# EAGLE schematic BARRERA (EAGLE 6.5.0)
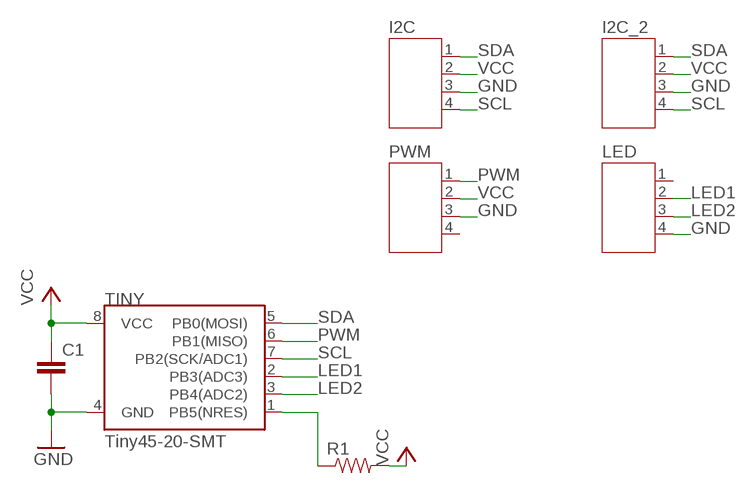
[diagram p0: schematic, sheet 1]

## Parts
C1  CAP0603-CAP  [0603-CAP]
I2C  JST-PH4  [JST-PH4]
I2C_2  JST-PH4  [JST-PH4]
LED  JST-PH4  [JST-PH4]
PWM  JST-PH4  [JST-PH4]
R1  RESISTOR0603  [0603-RES]
TINY  Tiny45-20-SMT  ATTINY45TINY45-20-SMT  [SO08-EIAJ]

## Nets
GND: C1.2 I2C.3 I2C_2.3 LED.4 PWM.3 TINY.4(GND)
LED1: LED.2 TINY.2(PB3(ADC3))
LED2: LED.3 TINY.3(PB4(ADC2))
N$3: R1.1 TINY.1(PB5(NRES))
PWM: PWM.1 TINY.6(PB1(MISO))
SCL: I2C.4 I2C_2.4 TINY.7(PB2(SCK/ADC1))
SDA: I2C.1 I2C_2.1 TINY.5(PB0(MOSI))
VCC: C1.1 I2C.2 I2C_2.2 PWM.2 R1.2 TINY.8(VCC)
Unconnected: LED.1 PWM.4

## Library data of the parts
C1 = SparkFun-Capacitors:CAP: Capacitor Standard 0603 ceramic capacitor, and 0.1" leaded capacitor.
I2C I2C_2 LED PWM = jst-ph:JST-PH4
R1 = SparkFun-Resistors:RESISTOR: Resistor Basic schematic elements and footprints for 0603, 1206, and PTH resistors.
TINY = SparkFun-DigitalIC:ATTINY45: Atmel 8-pin 2/4/8kB flash uC; PROD_ID: IC-08922